# EAGLE design Wheel_Encoder_Adapter_Schmitt_555 (EAGLE 6.3)
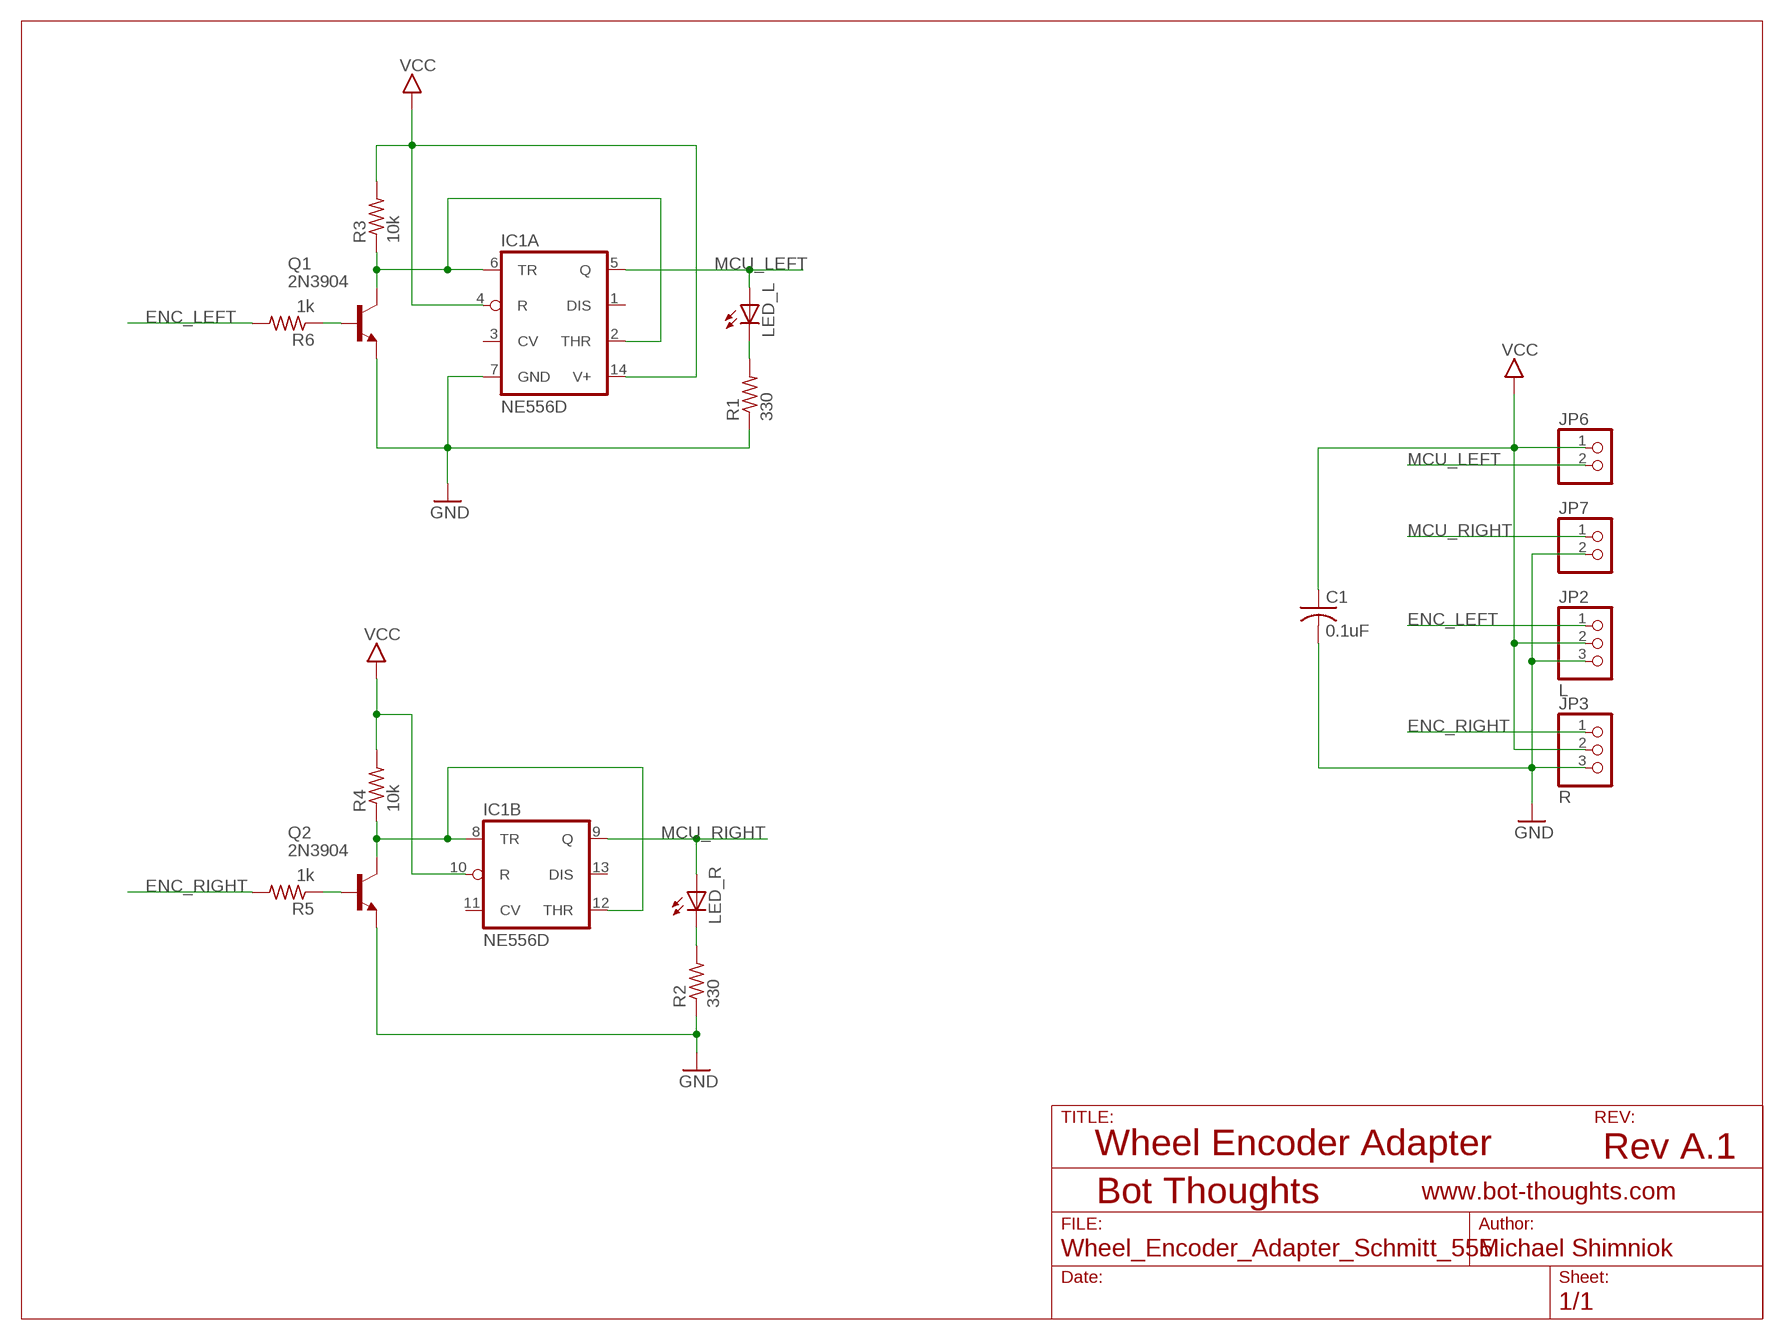
[diagram p0: schematic, sheet 1]

## Parts
C1  0.1uF  C-USC0603  [C0603]
IC1  NE556D  [SO14]
JP2  L  PINHD-1X03_2.54-S  [1X03-S]
JP3  R  PINHD-1X03_2.54-S  [1X03-S]
JP6  PINHD-1X02_2.54-S  [1X02-S]
JP7  PINHD-1X02_2.54-S  [1X02-S]
LED_L  LEDCHIPLED_0805  [CHIPLED_0805]
LED_R  LEDCHIPLED_0805  [CHIPLED_0805]
Q1  2N3904  2N3904SMD  [SOT-23]
Q2  2N3904  2N3904SMD  [SOT-23]
R1  330  R-US_R0603  [R0603]
R2  330  R-US_R0603  [R0603]
R3  10k  R-US_R0603  [R0603]
R4  10k  R-US_R0603  [R0603]
R5  1k  R-US_R0603  [R0603]
R6  1k  R-US_R0603  [R0603]

## Nets
ENC_LEFT: JP2.1 R6.2
ENC_RIGHT: JP3.1 R5.2
GND: C1.2 IC1.7(A:GND) JP2.3 JP3.3 JP7.2 Q1.2(E) Q2.2(E) R1.1 R2.1
MCU_LEFT: IC1.5(A:Q) JP6.2 LED_L.A
MCU_RIGHT: IC1.9(B:Q) JP7.1 LED_R.A
N$1: LED_L.C R1.2
N$2: LED_R.C R2.2
N$3: Q2.3(B) R5.1
N$4: Q1.3(B) R6.1
N$6: IC1.8(B:TR) IC1.12(B:THR) Q2.1(C) R4.1
N$7: IC1.2(A:THR) IC1.6(A:TR) Q1.1(C) R3.1
VCC: C1.1 IC1.4(A:R) IC1.10(B:R) IC1.14(A:V+) JP2.2 JP3.2 JP6.1 R3.2 R4.2
Unconnected: IC1.1(A:DIS) IC1.3(A:CV) IC1.11(B:CV) IC1.13(B:DIS)

## Notes on the sheet
- Wheel Encoder Adapter | Rev A.1

## Library data of the parts
C1 = rcl:C-US: CAPACITOR, American symbol
IC1 = linear:*556: Dual TIMER
JP2 JP3 = pinhead-2:PINHD-1X03: PIN HEADER
JP6 JP7 = pinhead-2:PINHD-1X02: PIN HEADER
LED_L LED_R = led:LED: LED OSRAM: - CHIPLED LG R971, LG N971, LY N971, LG Q971, LY Q971, LO R971, LY R971 LH N974, LH R974 LS Q976, LO Q976, LY Q976 LO Q996 - Hyper CHIPLED LW Q18S LB Q993, LB Q99A, LB R99A - SideLED LS A670, LO A670, LY A670, LG A670, LP A670 LB A673, LV A673, LT A673, LW A673 LH A674 LY A675 LS A676, LA A676, LO A676, LY A676, LW A676 LS A679, LY A679, LG A679 - Hyper Micro SIDELED® LS Y876, LA Y876, LO Y876, LY Y876 LT Y87S - SmartLED LW L88C, LW L88S LB L89C, LB L89S, LG L890 LS L89K, LO L89K, LY L89K LS L896, LA L896, LO L896, LY L896 - TOPLED LS T670, LO T670, LY T670, LG T670, LP T670 LSG T670, LSP T670, LSY T670, LOP T670, LYG T670 LG T671, LOG T671, LSG T671 LB T673, LV T673, LT T673, LW T673 LH T674 LS T676, LA T676, LO T676, LY T676, LB T676, LH T676, LSB T676, LW T676 LB T67C, LV T67C, LT T67C, LS T67K, LO T67K, LY T67K, LW E67C LS E67B, LA E67B, LO E67B, LY E67B, LB E67C, LV E67C, LT E67C LW T67C LS T679, LY T679, LG T679 LS T770, LO T770, LY T770, LG T770, LP T770 LB T773, LV T773, LT T773, LW T773 LH T774 LS E675, LA E675, LY E675, LS T675 LS T776, LA T776, LO T776, LY T776, LB T776 LHGB T686 LT T68C, LB T68C - Hyper Mini TOPLED® LB M676 - Mini TOPLED Santana® LG M470 LS M47K, LO M47K, LY M47K Source: http://www.osram.convergy.de LUXEON: - LUMILED® LXK2-PW12-R00, LXK2-PW12-S00, LXK2-PW14-U00, LXK2-PW14-V00 LXK2-PM12-R00, LXK2-PM12-S00, LXK2-PM14-U00 LXK2-PE12-Q00, LXK2-PE12-R00, LXK2-PE12-S00, LXK2-PE14-T00, LXK2-PE14-U00 LXK2-PB12-K00, LXK2-PB12-L00, LXK2-PB12-M00, LXK2-PB14-N00, LXK2-PB14-P00, LXK2-PB14-Q00 LXK2-PR12-L00, LXK2-PR12-M00, LXK2-PR14-Q00, LXK2-PR14-R00 LXK2-PD12-Q00, LXK2-PD12-R00, LXK2-PD12-S00 LXK2-PH12-R00, LXK2-PH12-S00 LXK2-PL12-P00, LXK2-PL12-Q00, LXK2-PL12-R00 Source: www.luxeon.com KINGBRIGHT: KA-3528ASYC Source: www.kingbright.com
Q1 Q2 = mes_transistors:2N3904: NPN Transistor Small signal NPN Bipolar Junction Transistor (BJT). Use this device to represent any of a number of such transistors with similar package and pinout: 2N4401, 2N3904, 2N2222, etc.
R1-R6 = rcl:R-US_: RESISTOR, American symbol

## Board
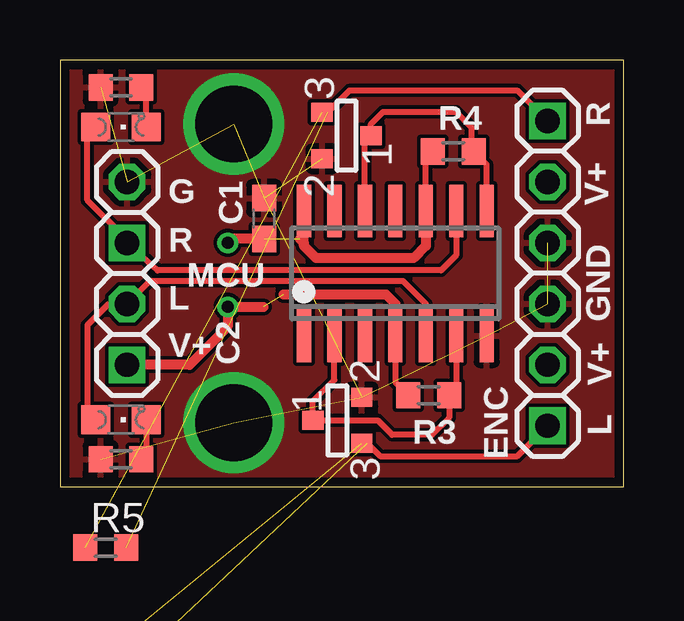
[diagram p1: board, top side]
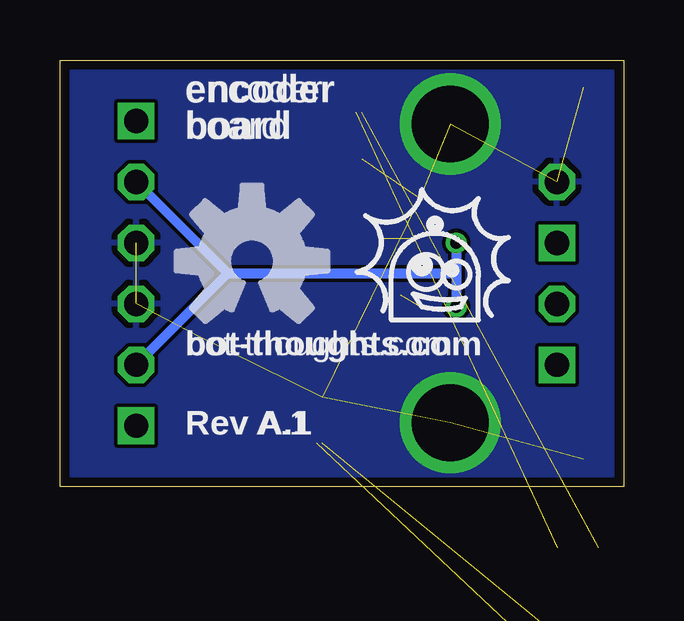
[diagram p2: board, bottom side, seen from below]

Size 23.5 x 17.78 mm. Coordinates in mm from the lower left corner, seen from the top.
Outline: 0,0 23.5,0 23.5,17.78 0,17.78 0,0
Copper layers (1*16): Top 0.0356mm / dielectric 1.5011mm / Bottom 0.0356mm
Design rules "default *": minimum track width 6mil, minimum drill 13mil, track to track 6mil, track to pad 6mil, pad to pad 6mil, via to via 6mil, smd to smd 6mil, copper to edge 15mil, drill to drill 6mil, minimum pad ring 7mil, minimum via ring 7mil, stop-mask expansion 4mil, vias tented up to drill 20mil, thermal gap 10mil

### Footprints (pad centres in the part's own frame; a part is rotated, then mirrored left to right if it is on the bottom)
C0603 = smd 1.1 x 1: 1 -0.85,0; 2 0.85,0
SO14 = smd 0.6 x 2.2: 1 -3.81,-2.6; 2 -2.54,-2.6; 3 -1.27,-2.6; 4 0,-2.6; 5 1.27,-2.6; 6 2.54,-2.6; 7 3.81,-2.6; 8 3.81,2.6; 9 2.54,2.6; 10 1.27,2.6; 11 0,2.6; 12 -1.27,2.6; 13 -2.54,2.6; 14 -3.81,2.6
1X03-S = drill 1.016 square: 1 -2.54,0 | drill 1.016 octagon: 2 0,0; 3 2.54,0
1X02-S = drill 1.016 square: 1 -1.27,0 | drill 1.016 octagon: 2 1.27,0
CHIPLED_0805 = smd 1.2 x 1.2: A 0,-1.05; C 0,1.05
SOT-23 = smd 0.787 x 0.889: 1 0.025,-1.016; 2 -0.94,1.016; 3 0.991,1.016
R0603 = smd 1 x 1.1: 1 -0.85,0; 2 0.85,0

### Placement (x,y rotation side)
C1  8.51,11.18 90 top
IC1  13.97,8.89 0 top
JP2  20.32,5.08 90 top
JP3  20.32,12.7 270 top
JP6  2.79,6.35 90 top
JP7  2.79,11.43 90 top
LED_L  2.54,2.79 270 top
LED_R  2.54,14.99 270 top
Q1  11.56,2.79 270 top
Q2  11.94,14.61 90 top
R1  2.54,1.14 0 top
R2  2.54,16.64 0 top
R3  15.37,3.81 180 top
R4  16.38,13.97 180 top
R5  1.91,-2.54 0 top
R6  1.91,-7.62 0 top  (outside the outline)

### Tracks (layer width: path | path; a pad name or v marks a point on that pad's centre or on a via)
ENC_LEFT  (1 unrouted)
  Top 0.254: JP2.1 19.05,1.27 13.34,1.27 12.8,1.8
ENC_RIGHT  (1 unrouted)
  Top 0.254: 11.15,15.6 12.06,16.51 19.05,16.51 JP3.1
GND  (via drill 3.2)  (10 unrouted)
  other vias: 7.24,15.11 7.24,2.67
  pour Top: 0,17.78 23.5,17.78 23.5,0 0,0
  pour Bottom: 0,0 23.5,0 23.5,17.78 0,17.78
MCU_LEFT
  Top 0.254: IC1.5 15.24,7.62 14.29,8.57 3.75,8.57 JP6.2 2.03,7.62 1.14,6.73 1.14,3.14 LED_L.A
MCU_RIGHT
  Top 0.254: IC1.9 16.51,9.65 15.88,9.02 4.06,9.02 JP7.1 2.79,10.29 1.14,11.94 1.14,14.77 LED_R.A
N$1
  Top 0.254: LED_L.C 3.59,1.47 R1.2
N$2
  Top 0.254: LED_R.C 3.59,16.31 R2.2
N$3  (1 unrouted)
N$4  (1 unrouted)
N$6
  Top 0.254: IC1.12 12.7,14.38 Q2.1 12.95,15.11 13.46,15.62 16.51,15.62 17.14,14.99 17.14,14.06 R4.1 17.78,13.42 IC1.8
N$7
  Top 0.254: IC1.2 11.43,4.45 10.54,3.56 Q1.1 13.23,2.77 13.84,2.16 15.49,2.16 16.22,2.88 R3.1 16.51,4.15 IC1.6
VCC  (via drill 0.51)  (2 unrouted)
  Top 0.254: IC1.4 13.97,4.36 R3.2 | IC1.10 15.24,13.68 R4.2
  Top 0.406: IC1.10 15.24,10.03 14.73,9.53 10.67,9.53 10.16,10.03 10.16,10.16 | 10.16,10.16 IC1.14 | IC1.4 13.97,7.62 13.59,8 9.31,8 | 9.99,10.33 10.16,10.16 | JP6.1 5.4,5.08 6.99,6.67 v6.99,7.49 8.47,7.49 | C1.1 7.15,10.33 v6.99,10.16
  Bottom 0.406: v6.99,10.16 6.99,8.89 | 6.99,8.89 v6.99,7.49 | JP3.2 16.51,8.89 | 16.51,8.89 JP2.2 | 16.51,8.89 6.99,8.89

### Text on the board
tPlace: MCU | ENC
tNames: V+ | G | R | GND | L | V+ | V+
bNames: encoder | board | bot-thoughts.com | Rev A.1
tsilk: R | R4 | V+ | G | C1 | R | GND | MCU | L | V+ | V+ | C2 | R3 | L | ENC
bsilk: encoder | board | bot-thoughts.com | Rev A.1